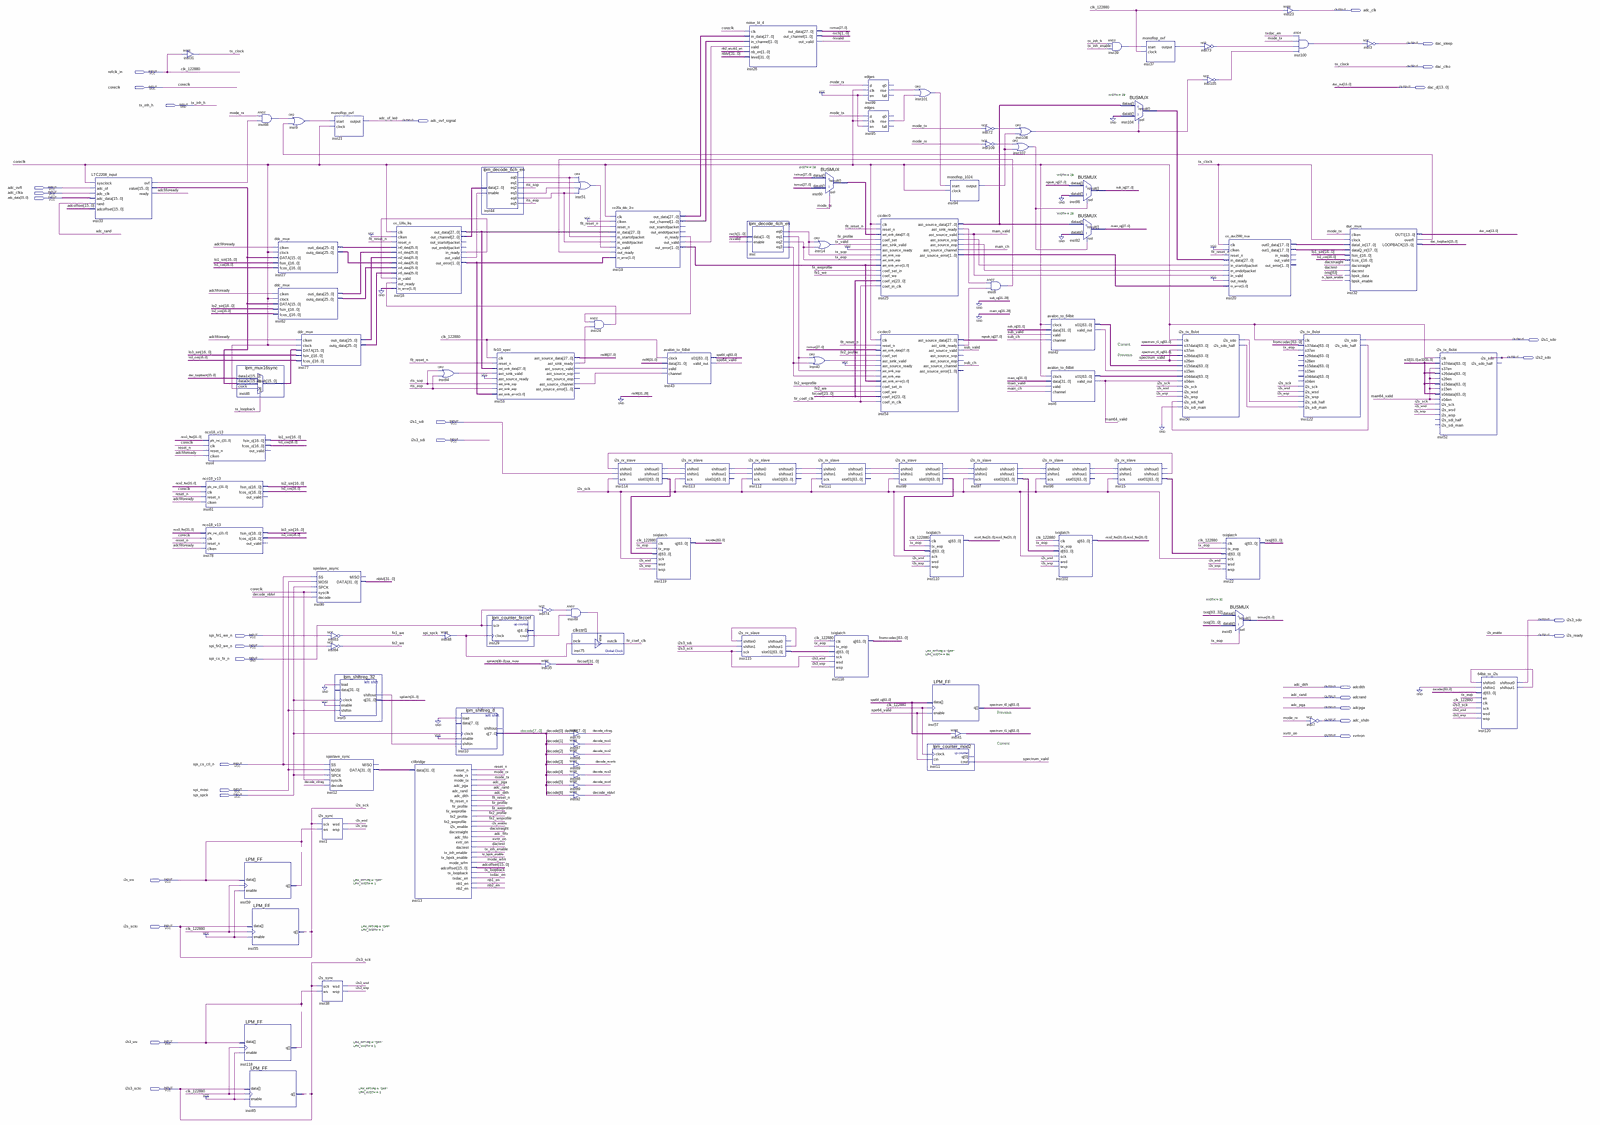
[diagram p0: schematic sheet, whole]
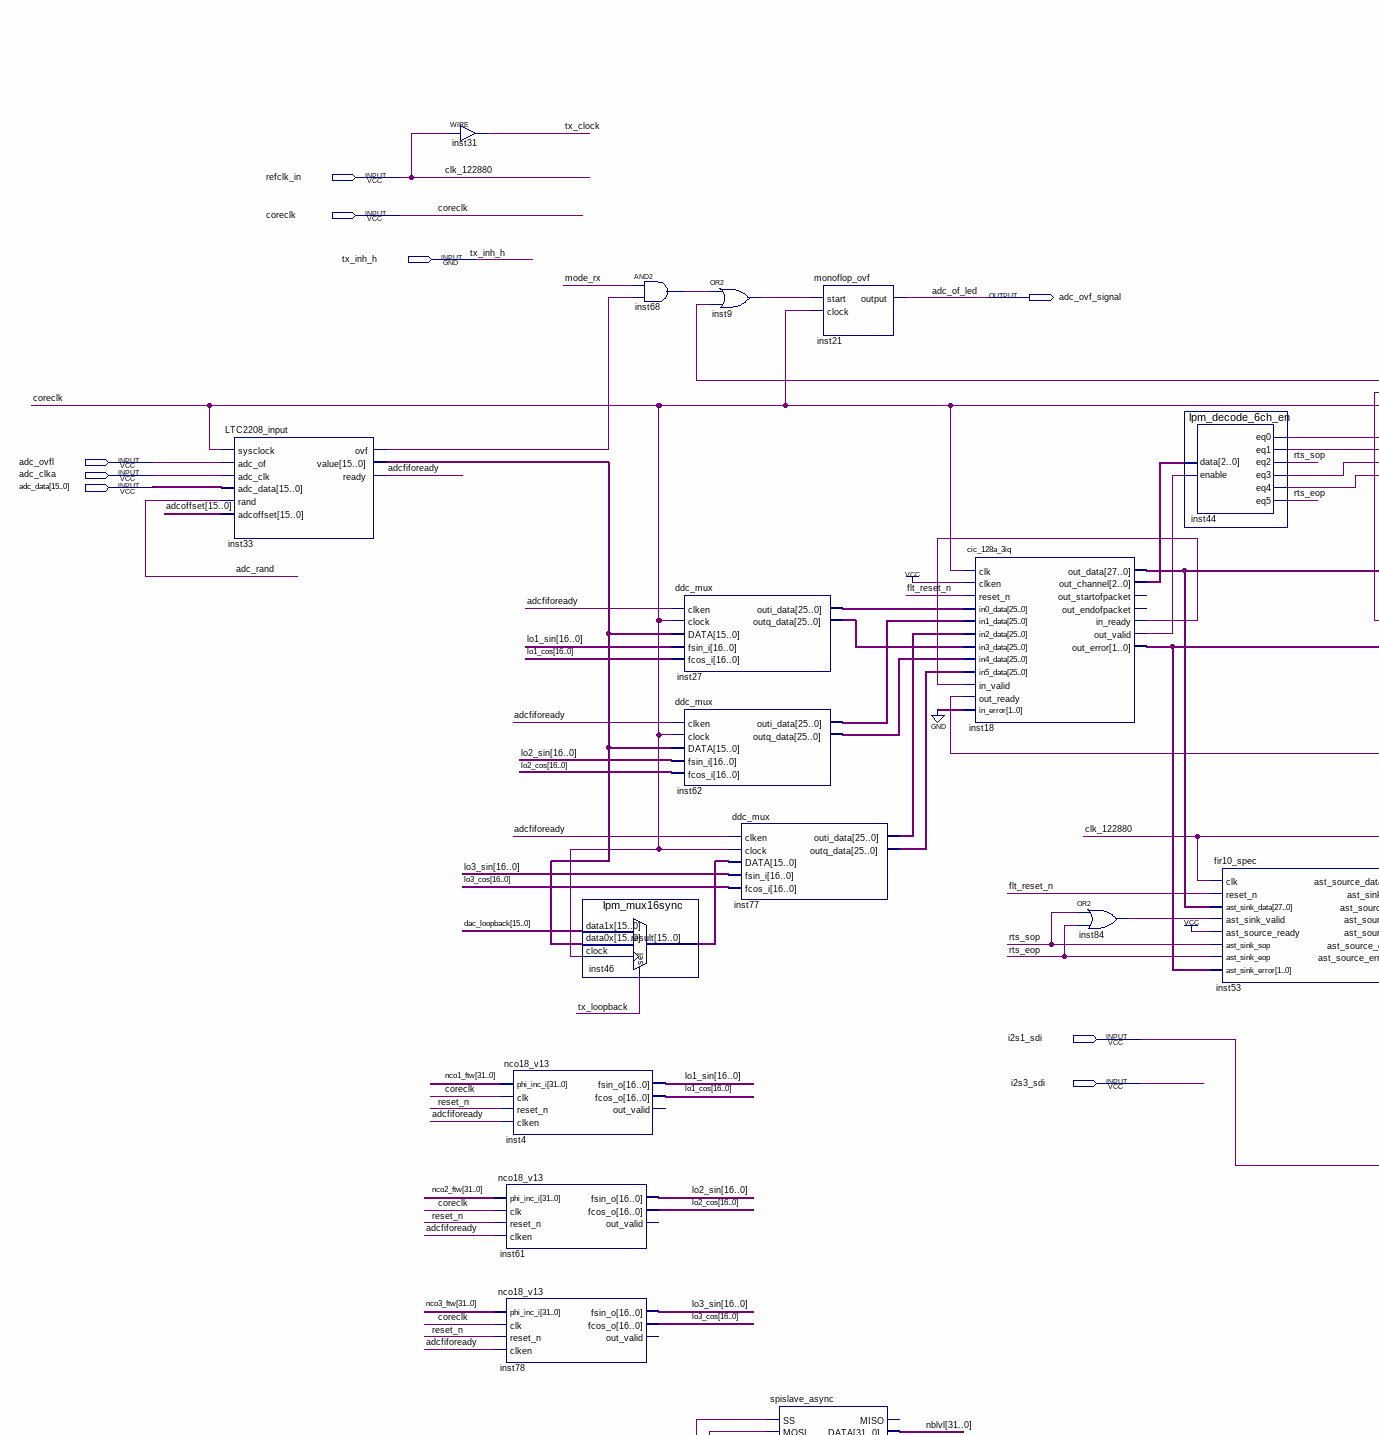
[diagram p1: schematic sheet, upper left part]
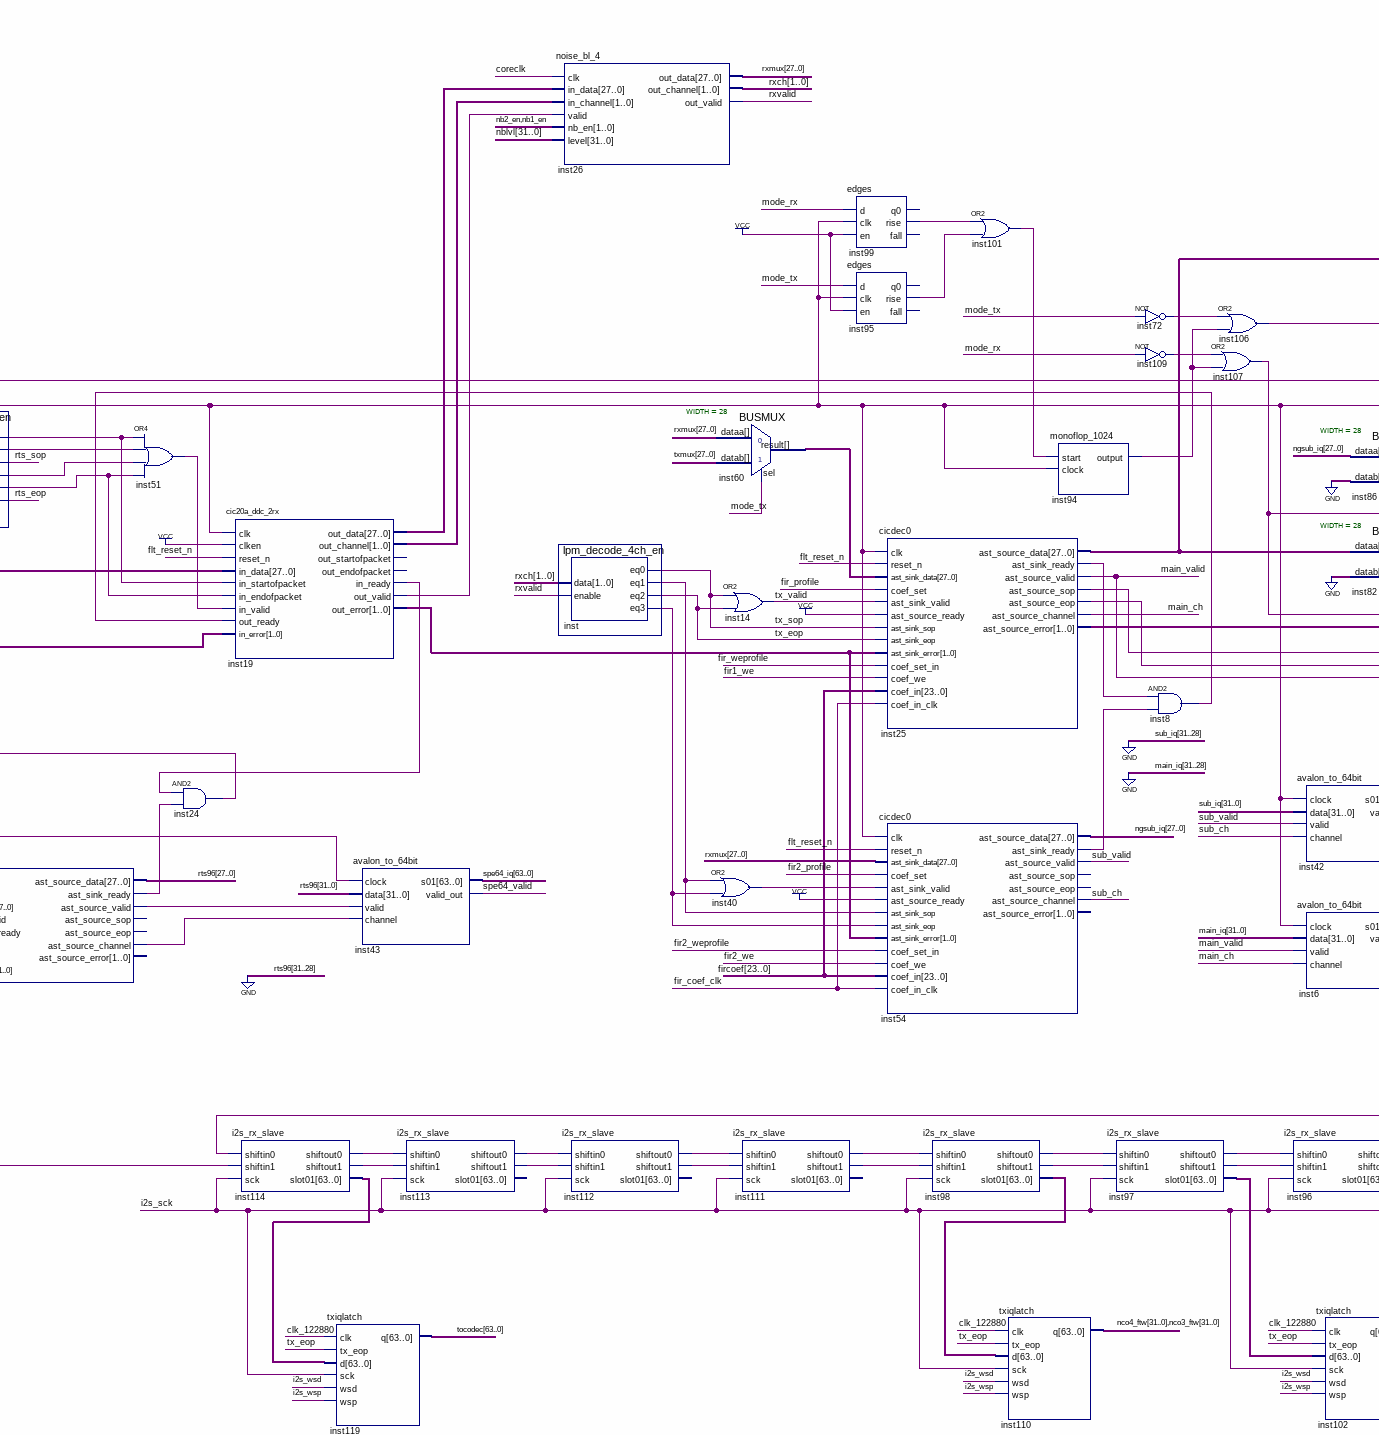
[diagram p2: schematic sheet, upper centre part]
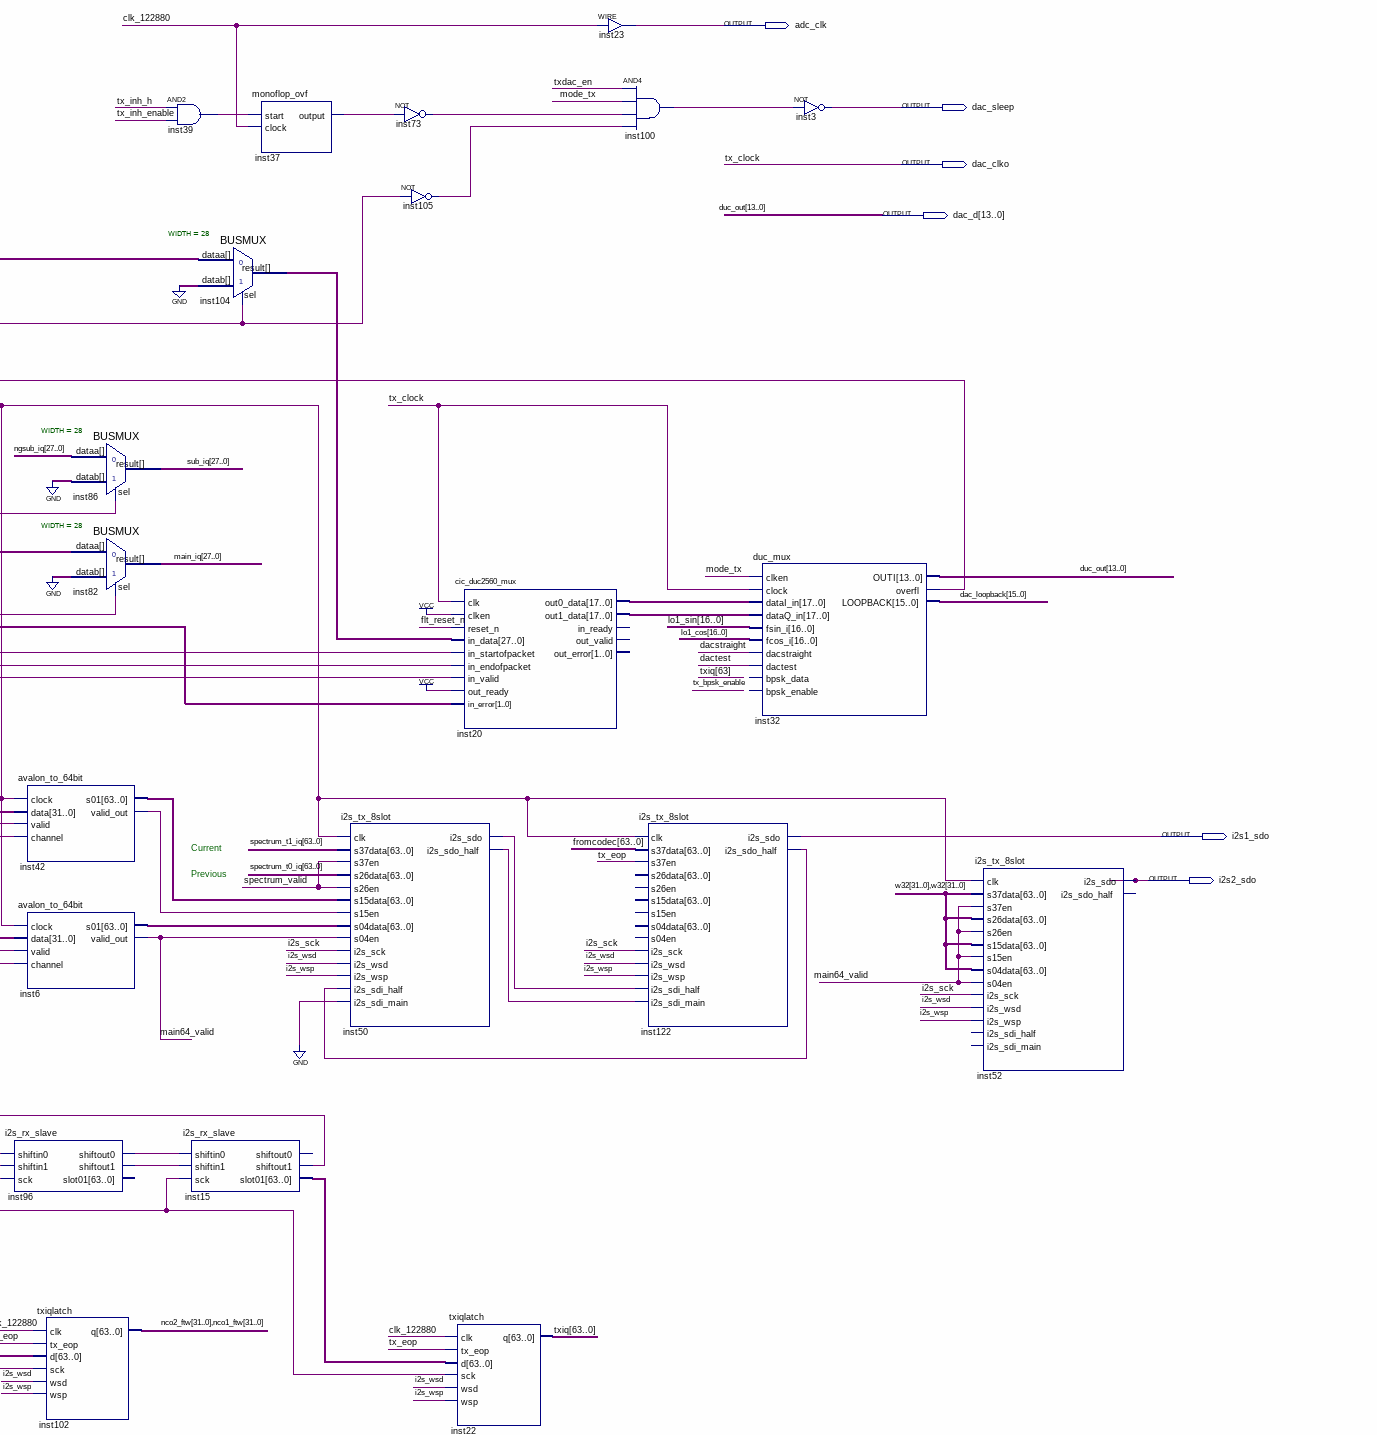
[diagram p3: schematic sheet, upper right part]
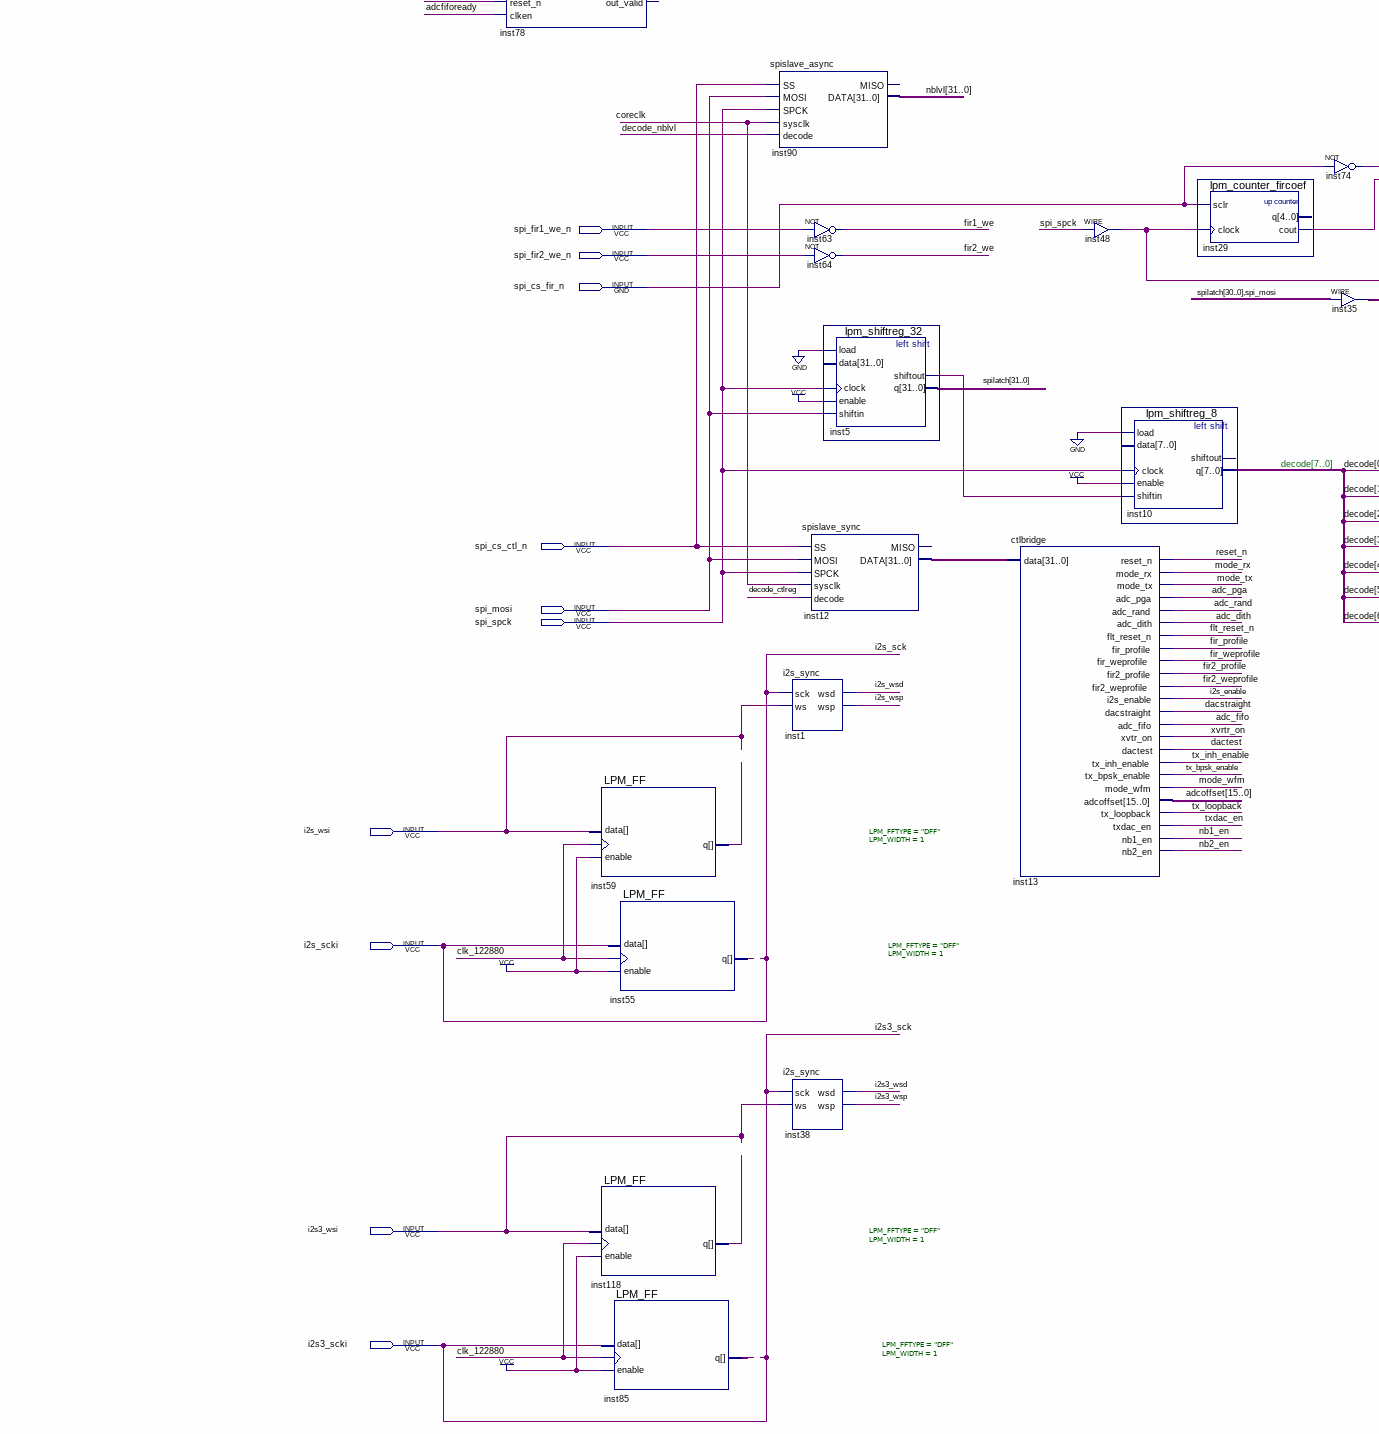
[diagram p4: schematic sheet, lower left part]
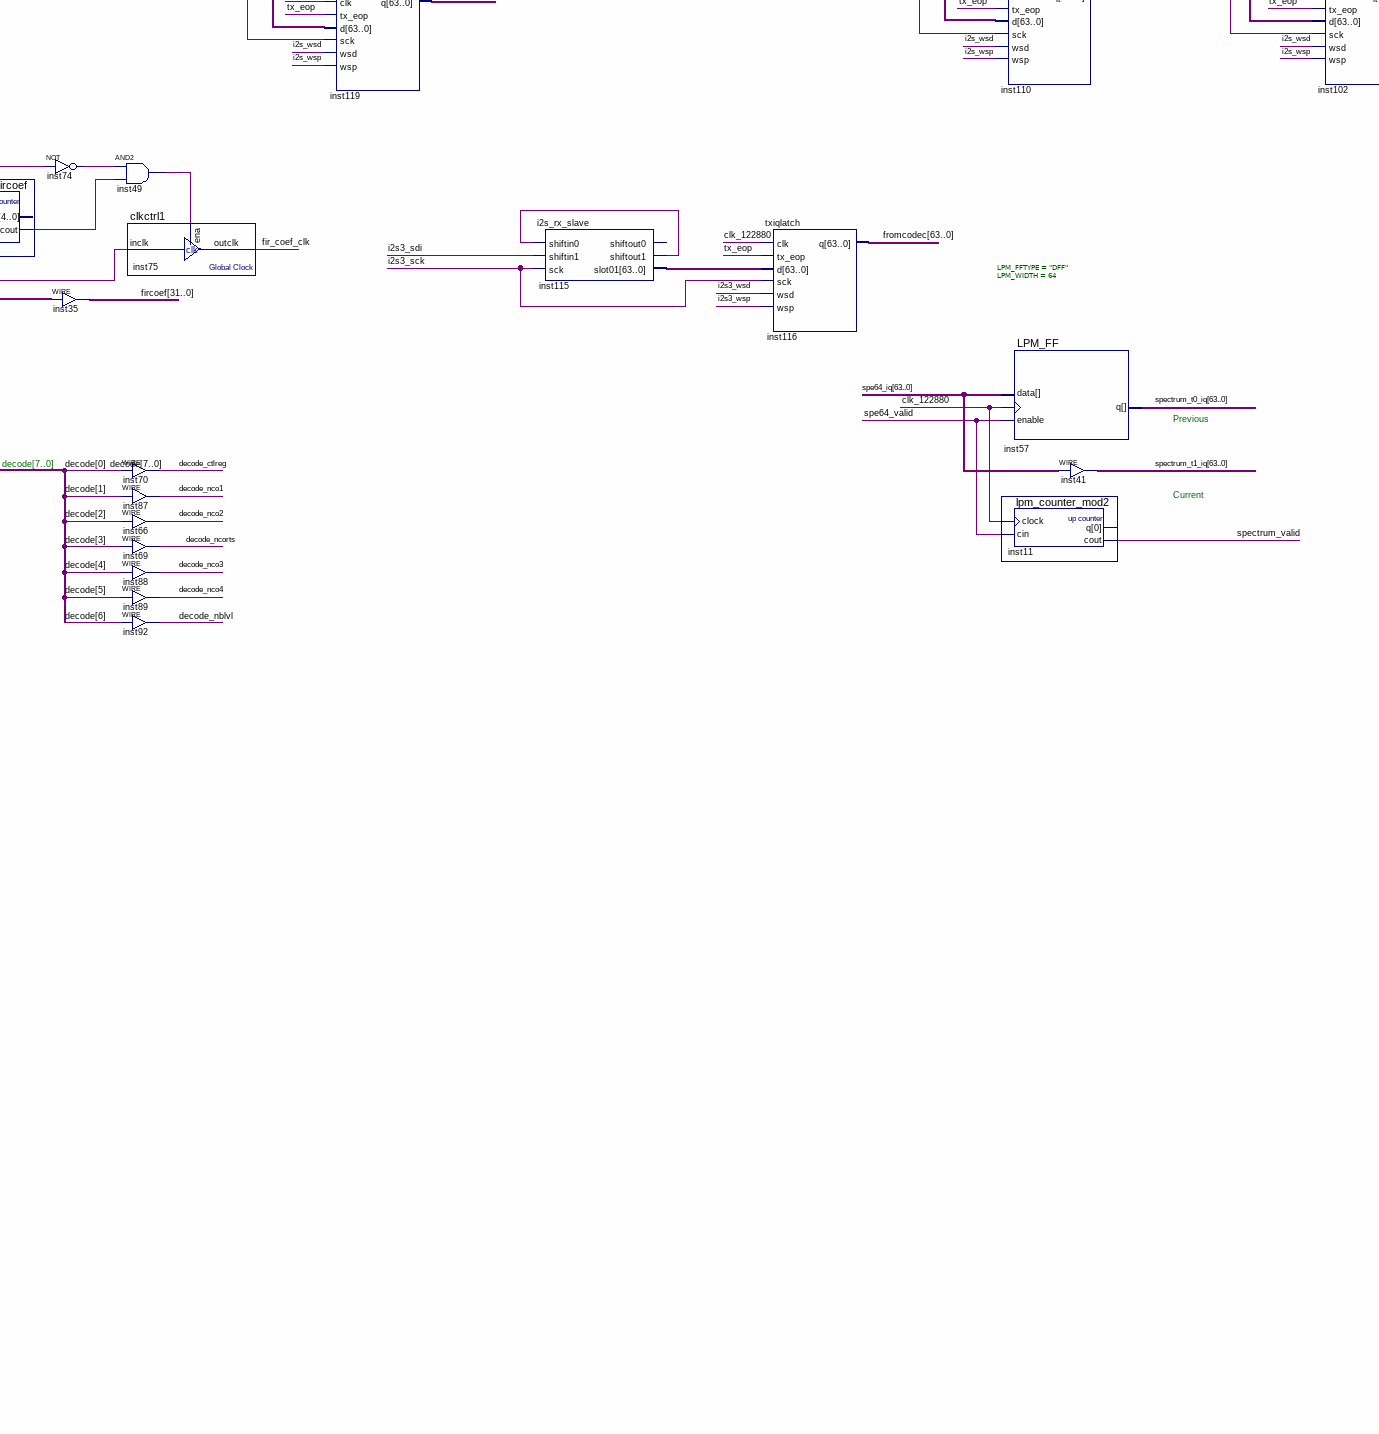
[diagram p5: schematic sheet, lower centre part]
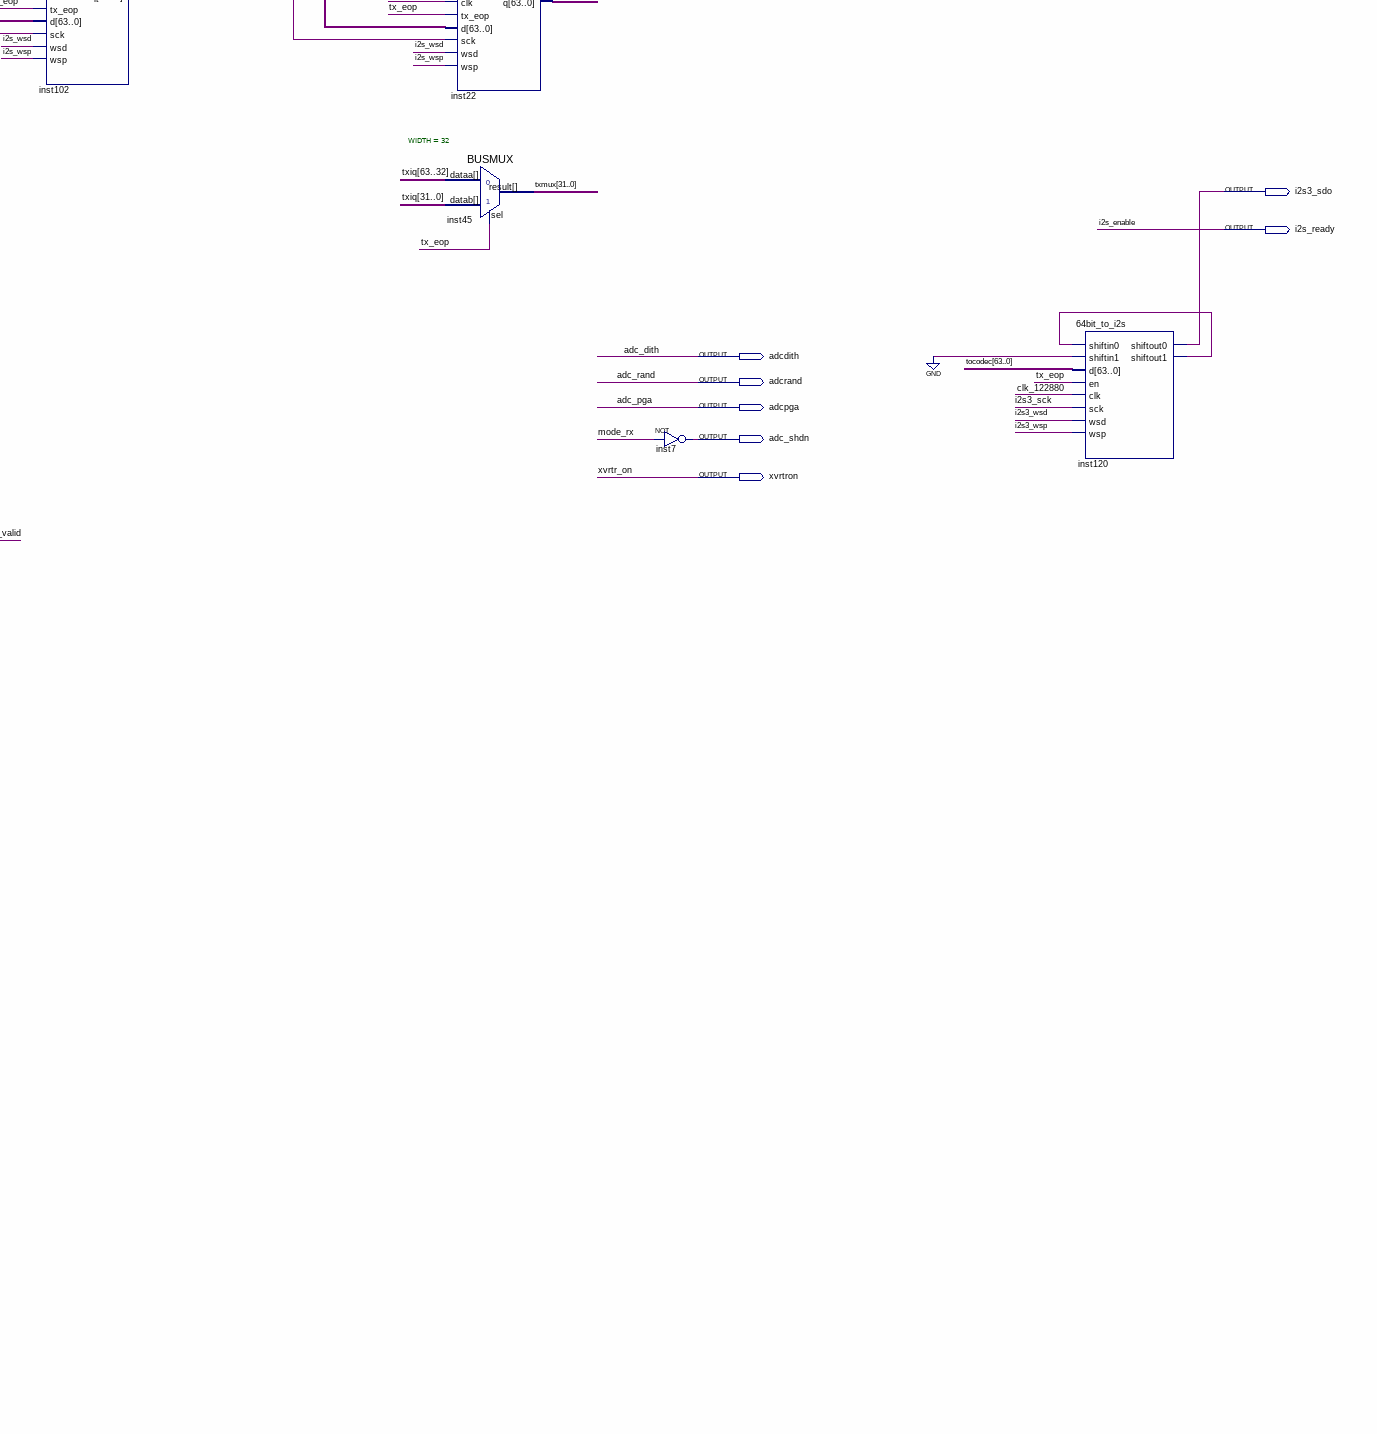
[diagram p6: schematic sheet, lower right part]
// Quartus schematic t1_2ch_transit.bdf as structural Verilog: 99 symbols, 32 pins
module t1_2ch_transit (
  input  refclk_in,
  input  coreclk,
  input  tx_inh_h,
  input  adc_ovfl,
  input  adc_clka,
  input  [15:0] adc_data,
  input  i2s1_sdi,
  input  i2s3_sdi,
  input  spi_fir1_we_n,
  input  spi_fir2_we_n,
  input  spi_cs_fir_n,
  input  spi_cs_ctl_n,
  input  spi_mosi,
  input  spi_spck,
  input  i2s_wsi,
  input  i2s_scki,
  input  i2s3_wsi,
  input  i2s3_scki,
  output adc_clk,
  output dac_sleep,
  output dac_clko,
  output [13:0] dac_d,
  output adc_ovf_signal,
  output i2s1_sdo,
  output i2s2_sdo,
  output i2s3_sdo,
  output i2s_ready,
  output adcdith,
  output adcrand,
  output adcpga,
  output adc_shdn,
  output xvrtron
);

  wire adc_fifo, adcfifoready, dacstraight, dactest, decode_ctlreg, decode_nblvl, decode_nco1, decode_nco2,
       decode_nco3, decode_nco4, decode_ncorts, fir1_we, fir2_profile, fir2_we, fir2_weprofile, fir_coef_clk,
       fir_profile, fir_weprofile, flt_reset_n, i2s3_wsd, i2s3_wsp, i2s_wsd, i2s_wsp, inst5_shiftout,
       inst8_out, inst9_out, inst15_shiftout1, inst18_in_ready, inst18_out_valid, inst19_in_ready,
       inst19_out_valid, inst24_out, inst25_ast_sink_ready, inst25_ast_source_eop, inst25_ast_source_sop,
       inst29_cout, inst32_overfl, inst33_ovf, inst37_output, inst39_out, inst40_out, inst42_valid_out,
       inst44_eq0, inst44_eq1, inst44_eq3, inst44_eq4, inst48_out, inst49_out, inst50_i2s_sdo,
       inst50_i2s_sdo_half, inst51_out, inst53_ast_sink_ready, inst53_ast_source_channel,
       inst53_ast_source_valid, inst54_ast_sink_ready, inst55_q, inst59_q, inst68_out, inst72_out,
       inst73_out, inst74_out, inst84_out, inst85_q, inst94_output, inst95_rise, inst96_shiftout0,
       inst96_shiftout1, inst97_shiftout0, inst97_shiftout1, inst98_shiftout0, inst98_shiftout1, inst99_rise,
       inst100_out, inst101_out, inst105_out, inst106_out, inst107_out, inst109_out, inst111_shiftout0,
       inst111_shiftout1, inst112_shiftout0, inst112_shiftout1, inst113_shiftout0, inst113_shiftout1,
       inst114_shiftout0, inst114_shiftout1, inst115_shiftout1, inst118_q, inst120_shiftout1,
       inst122_i2s_sdo_half, inst_eq1, inst_eq3, main64_valid, main_ch, main_valid, mode_rx, mode_tx,
       mode_wfm, nb1_en, nb2_en, reset_n, rts_eop, rts_sop, rxvalid, spe64_valid, spectrum_valid, sub_ch,
       sub_valid, tx_bpsk_enable, tx_eop, tx_inh_enable, tx_loopback, tx_sop, tx_valid, txdac_en;
  wire [1:0] inst18_out_error, inst19_out_channel, inst19_out_error, inst25_ast_source_error, rxch;
  wire [2:0] inst18_out_channel;
  wire [7:0] decode;
  wire [15:0] adcoffset, dac_loopback, inst33_value, inst46_result;
  wire [16:0] lo1_cos, lo1_sin, lo2_cos, lo2_sin, lo3_cos, lo3_sin;
  wire [17:0] inst20_out0_data, inst20_out1_data;
  wire [25:0] inst27_outi_data, inst27_outq_data, inst62_outi_data, inst62_outq_data, inst77_outi_data,
       inst77_outq_data;
  wire [27:0] inst18_out_data, inst19_out_data, inst25_ast_source_data, inst60_result, inst104_result,
       main_iq, ngsub_iq, rts96, rxmux, sub_iq;
  wire [31:0] fircoef, inst12_data, nblvl, nco1_ftw, nco2_ftw, nco3_ftw, nco4_ftw, spilatch, txmux, w32;
  wire [63:0] fromcodec, inst6_s01, inst15_slot01, inst42_s01, inst97_slot01, inst98_slot01, inst114_slot01,
       inst115_slot01, spe64_iq, spectrum_t0_iq, spectrum_t1_iq, tocodec, txiq;

  LTC2208_input inst33 (
    .sysclock(coreclk), .adc_of(adc_ovfl), .adc_clk(adc_clka), .adc_data(adc_data), .\rand (adcrand),
    .adcoffset(adcoffset), .ovf(inst33_ovf), .value(inst33_value), .ready(adcfifoready));
  assign dac_clko = refclk_in;  // WIRE inst31
  nco18_v13 inst4 (
    .phi_inc_i(nco1_ftw), .clk(coreclk), .reset_n(reset_n), .clken(adcfifoready), .fsin_o(lo1_sin),
    .fcos_o(lo1_cos));  // open: out_valid
  nco18_v13 inst61 (
    .phi_inc_i(nco2_ftw), .clk(coreclk), .reset_n(reset_n), .clken(adcfifoready), .fsin_o(lo2_sin),
    .fcos_o(lo2_cos));  // open: out_valid
  nco18_v13 inst78 (
    .phi_inc_i(nco3_ftw), .clk(coreclk), .reset_n(reset_n), .clken(adcfifoready), .fsin_o(lo3_sin),
    .fcos_o(lo3_cos));  // open: out_valid
  lpm_mux16sync inst46 (
    .data1x(dac_loopback), .data0x(inst33_value), .clock(coreclk), .sel(tx_loopback), .result(inst46_result));
  LPM_FF #(.LPM_FFTYPE("DFF"), .LPM_WIDTH(1)) inst59 (.enable(1'b1), .clock(refclk_in), .data(i2s_wsi), .q(inst59_q));
  LPM_FF #(.LPM_FFTYPE("DFF"), .LPM_WIDTH(1)) inst118 (
    .enable(1'b1), .clock(refclk_in), .data(i2s3_wsi), .q(inst118_q));
  LPM_FF #(.LPM_FFTYPE("DFF"), .LPM_WIDTH(1)) inst85 (.enable(1'b1), .clock(refclk_in), .data(i2s3_scki), .q(inst85_q));
  and inst68 (inst68_out, mode_rx, inst33_ovf);
  LPM_FF #(.LPM_FFTYPE("DFF"), .LPM_WIDTH(1)) inst55 (.enable(1'b1), .clock(refclk_in), .data(i2s_scki), .q(inst55_q));
  ddc_mux inst27 (
    .clken(adcfifoready), .clock(coreclk), .DATA(inst33_value), .fsin_i(lo1_sin), .fcos_i(lo1_cos),
    .outi_data(inst27_outi_data), .outq_data(inst27_outq_data));
  ddc_mux inst62 (
    .clken(adcfifoready), .clock(coreclk), .DATA(inst33_value), .fsin_i(lo2_sin), .fcos_i(lo2_cos),
    .outi_data(inst62_outi_data), .outq_data(inst62_outq_data));
  or inst9 (inst9_out, inst68_out, inst32_overfl);
  ddc_mux inst77 (
    .clken(adcfifoready), .clock(coreclk), .DATA(inst46_result), .fsin_i(lo3_sin), .fcos_i(lo3_cos),
    .outi_data(inst77_outi_data), .outq_data(inst77_outq_data));
  spislave_async inst90 (
    .SS(spi_cs_ctl_n), .MOSI(spi_mosi), .SPCK(spi_spck), .sysclk(coreclk), .decode(decode_nblvl), .DATA(nblvl));  // open: MISO
  not inst63 (fir1_we, spi_fir1_we_n);
  not inst64 (fir2_we, spi_fir2_we_n);
  spislave_sync inst12 (
    .SS(spi_cs_ctl_n), .MOSI(spi_mosi), .SPCK(spi_spck), .sysclk(coreclk), .decode(decode_ctlreg),
    .DATA(inst12_data));  // open: MISO
  i2s_sync inst1 (.sck(i2s_scki), .ws(i2s_wsi), .wsd(i2s_wsd), .wsp(i2s_wsp));
  i2s_sync inst38 (.sck(i2s3_scki), .ws(i2s3_wsi), .wsd(i2s3_wsd), .wsp(i2s3_wsp));
  monoflop_ovf inst21 (.start(inst9_out), .clock(coreclk), .\output (adc_ovf_signal));
  lpm_shiftreg_32 inst5 (
    .load(1'b0), .clock(spi_spck), .enable(1'b1), .shiftin(spi_mosi), .shiftout(inst5_shiftout), .q(spilatch));  // open: data
  cic_128a_3iq inst18 (
    .clk(coreclk), .clken(1'b1), .reset_n(flt_reset_n), .in0_data(inst27_outi_data),
    .in1_data(inst62_outi_data), .in2_data(inst77_outi_data), .in3_data(inst27_outq_data),
    .in4_data(inst62_outq_data), .in5_data(inst77_outq_data), .in_valid(inst18_in_ready),
    .out_ready(inst24_out), .in_error(2'b00), .out_data(inst18_out_data), .out_channel(inst18_out_channel),
    .in_ready(inst18_in_ready), .out_valid(inst18_out_valid), .out_error(inst18_out_error));  // open: out_startofpacket, out_endofpacket
  ctlbridge inst13 (
    .data(inst12_data), .reset_n(reset_n), .mode_rx(mode_rx), .mode_tx(mode_tx), .adc_pga(adcpga),
    .adc_rand(adcrand), .adc_dith(adcdith), .flt_reset_n(flt_reset_n), .fir_profile(fir_profile),
    .fir_weprofile(fir_weprofile), .fir2_profile(fir2_profile), .fir2_weprofile(fir2_weprofile),
    .i2s_enable(i2s_ready), .dacstraight(dacstraight), .adc_fifo(adc_fifo), .xvtr_on(xvrtron),
    .dactest(dactest), .tx_inh_enable(tx_inh_enable), .tx_bpsk_enable(tx_bpsk_enable), .mode_wfm(mode_wfm),
    .adcoffset(adcoffset), .tx_loopback(tx_loopback), .txdac_en(txdac_en), .nb1_en(nb1_en), .nb2_en(nb2_en));
  or inst84 (inst84_out, rts_sop, rts_eop);
  assign inst48_out = spi_spck;  // WIRE inst48
  lpm_shiftreg_8 inst10 (
    .load(1'b0), .clock(spi_spck), .enable(1'b1), .shiftin(inst5_shiftout), .q(decode));  // open: data, shiftout
  lpm_decode_6ch_en inst44 (
    .data(inst18_out_channel), .enable(inst18_out_valid), .eq0(inst44_eq0), .eq1(inst44_eq1), .eq2(rts_sop),
    .eq3(inst44_eq3), .eq4(inst44_eq4), .eq5(rts_eop));
  fir10_spec inst53 (
    .clk(refclk_in), .reset_n(flt_reset_n), .ast_sink_data(inst18_out_data), .ast_sink_valid(inst84_out),
    .ast_source_ready(1'b1), .ast_sink_sop(rts_sop), .ast_sink_eop(rts_eop),
    .ast_sink_error(inst18_out_error), .ast_source_data(rts96), .ast_sink_ready(inst53_ast_sink_ready),
    .ast_source_valid(inst53_ast_source_valid), .ast_source_channel(inst53_ast_source_channel));  // open: ast_source_sop, ast_source_eop, ast_source_error
  lpm_counter_fircoef inst29 (.sclr(spi_cs_fir_n), .clock(inst48_out), .cout(inst29_cout));  // open: q
  not inst74 (inst74_out, spi_cs_fir_n);
  assign fircoef = {spilatch[30:0], spi_mosi};  // WIRE inst35
  or inst51 (inst51_out, inst44_eq0, inst44_eq1, inst44_eq3, inst44_eq4);
  and inst49 (inst49_out, inst74_out, inst29_cout);
  clkctrl1 inst75 (.inclk(inst48_out), .ena(inst49_out), .outclk(fir_coef_clk));
  assign decode_ctlreg = decode[0];  // WIRE inst70
  assign decode_nco1 = decode[1];  // WIRE inst87
  assign decode_nco2 = decode[2];  // WIRE inst66
  assign decode_ncorts = decode[3];  // WIRE inst69
  assign decode_nco3 = decode[4];  // WIRE inst88
  assign decode_nco4 = decode[5];  // WIRE inst89
  assign decode_nblvl = decode[6];  // WIRE inst92
  and inst24 (inst24_out, inst19_in_ready, inst53_ast_sink_ready);
  cic20a_ddc_2rx inst19 (
    .clk(coreclk), .clken(1'b1), .reset_n(flt_reset_n), .in_data(inst18_out_data),
    .in_startofpacket(inst44_eq0), .in_endofpacket(inst44_eq4), .in_valid(inst51_out), .out_ready(inst8_out),
    .in_error(inst18_out_error), .out_data(inst19_out_data), .out_channel(inst19_out_channel),
    .in_ready(inst19_in_ready), .out_valid(inst19_out_valid), .out_error(inst19_out_error));  // open: out_startofpacket, out_endofpacket
  i2s_rx_slave inst114 (
    .shiftin0(inst15_shiftout1), .shiftin1(i2s1_sdi), .sck(i2s_scki), .shiftout0(inst114_shiftout0),
    .shiftout1(inst114_shiftout1), .slot01(inst114_slot01));
  txiqlatch inst119 (
    .clk(refclk_in), .tx_eop(tx_eop), .d(inst114_slot01), .sck(i2s_scki), .wsd(i2s_wsd), .wsp(i2s_wsp),
    .q(tocodec));
  avalon_to_64bit inst43 (
    .clock(refclk_in), .data({4'b0000, rts96}), .valid(inst53_ast_source_valid),
    .channel(inst53_ast_source_channel), .s01(spe64_iq), .valid_out(spe64_valid));
  i2s_rx_slave inst113 (
    .shiftin0(inst114_shiftout0), .shiftin1(inst114_shiftout1), .sck(i2s_scki),
    .shiftout0(inst113_shiftout0), .shiftout1(inst113_shiftout1));  // open: slot01
  i2s_rx_slave inst115 (
    .shiftin0(inst115_shiftout1), .shiftin1(i2s3_sdi), .sck(i2s3_scki), .shiftout1(inst115_shiftout1),
    .slot01(inst115_slot01));  // open: shiftout0
  noise_bl_4 inst26 (
    .clk(coreclk), .in_data(inst19_out_data), .in_channel(inst19_out_channel), .valid(inst19_out_valid),
    .nb_en({nb2_en, nb1_en}), .level(nblvl), .out_data(rxmux), .out_channel(rxch), .out_valid(rxvalid));
  lpm_decode_4ch_en inst (.data(rxch), .enable(rxvalid), .eq0(tx_sop), .eq1(inst_eq1), .eq2(tx_eop), .eq3(inst_eq3));
  i2s_rx_slave inst112 (
    .shiftin0(inst113_shiftout0), .shiftin1(inst113_shiftout1), .sck(i2s_scki),
    .shiftout0(inst112_shiftout0), .shiftout1(inst112_shiftout1));  // open: slot01
  BUSMUX #(.WIDTH(28)) inst60 (.datab(txmux[27:0]), .sel(mode_tx), .dataa(rxmux), .result(inst60_result));
  or inst14 (tx_valid, tx_sop, tx_eop);
  or inst40 (inst40_out, inst_eq1, inst_eq3);
  i2s_rx_slave inst111 (
    .shiftin0(inst112_shiftout0), .shiftin1(inst112_shiftout1), .sck(i2s_scki),
    .shiftout0(inst111_shiftout0), .shiftout1(inst111_shiftout1));  // open: slot01
  txiqlatch inst116 (
    .clk(refclk_in), .tx_eop(tx_eop), .d(inst115_slot01), .sck(i2s3_scki), .wsd(i2s3_wsd), .wsp(i2s3_wsp),
    .q(fromcodec));
  edges inst99 (.d(mode_rx), .clk(coreclk), .en(1'b1), .rise(inst99_rise));  // open: q0, fall
  edges inst95 (.d(mode_tx), .clk(coreclk), .en(1'b1), .rise(inst95_rise));  // open: q0, fall
  cicdec0 inst25 (
    .clk(coreclk), .reset_n(flt_reset_n), .ast_sink_data(inst60_result), .coef_set(fir_profile),
    .ast_sink_valid(tx_valid), .ast_source_ready(1'b1), .ast_sink_sop(tx_sop), .ast_sink_eop(tx_eop),
    .ast_sink_error(inst19_out_error), .coef_set_in(fir_weprofile), .coef_we(fir1_we),
    .coef_in(fircoef[23:0]), .coef_in_clk(fir_coef_clk), .ast_source_data(inst25_ast_source_data),
    .ast_sink_ready(inst25_ast_sink_ready), .ast_source_valid(main_valid),
    .ast_source_sop(inst25_ast_source_sop), .ast_source_eop(inst25_ast_source_eop),
    .ast_source_channel(main_ch), .ast_source_error(inst25_ast_source_error));
  cicdec0 inst54 (
    .clk(coreclk), .reset_n(flt_reset_n), .ast_sink_data(rxmux), .coef_set(fir2_profile),
    .ast_sink_valid(inst40_out), .ast_source_ready(1'b1), .ast_sink_sop(inst_eq1), .ast_sink_eop(inst_eq3),
    .ast_sink_error(inst19_out_error), .coef_set_in(fir2_weprofile), .coef_we(fir2_we),
    .coef_in(fircoef[23:0]), .coef_in_clk(fir_coef_clk), .ast_source_data(ngsub_iq),
    .ast_sink_ready(inst54_ast_sink_ready), .ast_source_valid(sub_valid), .ast_source_channel(sub_ch));  // open: ast_source_sop, ast_source_eop, ast_source_error
  i2s_rx_slave inst98 (
    .shiftin0(inst111_shiftout0), .shiftin1(inst111_shiftout1), .sck(i2s_scki), .shiftout0(inst98_shiftout0),
    .shiftout1(inst98_shiftout1), .slot01(inst98_slot01));
  or inst101 (inst101_out, inst99_rise, inst95_rise);
  txiqlatch inst110 (
    .clk(refclk_in), .tx_eop(tx_eop), .d(inst98_slot01), .sck(i2s_scki), .wsd(i2s_wsd), .wsp(i2s_wsp),
    .q({nco4_ftw, nco3_ftw}));
  monoflop_1024 inst94 (.start(inst101_out), .clock(coreclk), .\output (inst94_output));
  LPM_FF #(.LPM_FFTYPE("DFF"), .LPM_WIDTH(64)) inst57 (
    .enable(spe64_valid), .clock(refclk_in), .data(spe64_iq), .q(spectrum_t0_iq));
  lpm_counter_mod2 inst11 (.clock(refclk_in), .cin(spe64_valid), .cout(spectrum_valid));  // open: q
  assign spectrum_t1_iq = spe64_iq;  // WIRE inst41
  not inst72 (inst72_out, mode_tx);
  not inst109 (inst109_out, mode_rx);
  and inst8 (inst8_out, inst25_ast_sink_ready, inst54_ast_sink_ready);
  i2s_rx_slave inst97 (
    .shiftin0(inst98_shiftout0), .shiftin1(inst98_shiftout1), .sck(i2s_scki), .shiftout0(inst97_shiftout0),
    .shiftout1(inst97_shiftout1), .slot01(inst97_slot01));
  or inst106 (inst106_out, inst72_out, inst94_output);
  or inst107 (inst107_out, inst109_out, inst94_output);
  avalon_to_64bit inst42 (
    .clock(coreclk), .data({4'b0000, sub_iq}), .valid(sub_valid), .channel(sub_ch), .s01(inst42_s01),
    .valid_out(inst42_valid_out));
  avalon_to_64bit inst6 (
    .clock(coreclk), .data({4'b0000, main_iq}), .valid(main_valid), .channel(main_ch), .s01(inst6_s01),
    .valid_out(main64_valid));
  i2s_rx_slave inst96 (
    .shiftin0(inst97_shiftout0), .shiftin1(inst97_shiftout1), .sck(i2s_scki), .shiftout0(inst96_shiftout0),
    .shiftout1(inst96_shiftout1));  // open: slot01
  BUSMUX #(.WIDTH(28)) inst86 (.datab({28{1'b0}}), .sel(inst107_out), .dataa(ngsub_iq), .result(sub_iq));
  BUSMUX #(.WIDTH(28)) inst82 (.datab({28{1'b0}}), .sel(inst107_out), .dataa(inst25_ast_source_data), .result(main_iq));
  txiqlatch inst102 (
    .clk(refclk_in), .tx_eop(tx_eop), .d(inst97_slot01), .sck(i2s_scki), .wsd(i2s_wsd), .wsp(i2s_wsp),
    .q({nco2_ftw, nco1_ftw}));
  and inst39 (inst39_out, tx_inh_h, tx_inh_enable);
  BUSMUX #(.WIDTH(28)) inst104 (
    .datab({28{1'b0}}), .sel(inst106_out), .dataa(inst25_ast_source_data), .result(inst104_result));
  i2s_rx_slave inst15 (
    .shiftin0(inst96_shiftout0), .shiftin1(inst96_shiftout1), .sck(i2s_scki), .shiftout1(inst15_shiftout1),
    .slot01(inst15_slot01));  // open: shiftout0
  monoflop_ovf inst37 (.start(inst39_out), .clock(refclk_in), .\output (inst37_output));
  i2s_tx_8slot inst50 (
    .clk(coreclk), .s37data(spectrum_t1_iq), .s37en(spectrum_valid), .s26data(spectrum_t0_iq),
    .s26en(spectrum_valid), .s15data(inst42_s01), .s15en(inst42_valid_out), .s04data(inst6_s01),
    .s04en(main64_valid), .i2s_sck(i2s_scki), .i2s_wsd(i2s_wsd), .i2s_wsp(i2s_wsp),
    .i2s_sdi_half(inst122_i2s_sdo_half), .i2s_sdi_main(1'b0), .i2s_sdo(inst50_i2s_sdo),
    .i2s_sdo_half(inst50_i2s_sdo_half));
  not inst73 (inst73_out, inst37_output);
  not inst105 (inst105_out, inst106_out);
  cic_duc2560_mux inst20 (
    .clk(dac_clko), .clken(1'b1), .reset_n(flt_reset_n), .in_data(inst104_result),
    .in_startofpacket(inst25_ast_source_sop), .in_endofpacket(inst25_ast_source_eop), .in_valid(main_valid),
    .out_ready(1'b1), .in_error(inst25_ast_source_error), .out0_data(inst20_out0_data),
    .out1_data(inst20_out1_data));  // open: in_ready, out_valid, out_error
  txiqlatch inst22 (
    .clk(refclk_in), .tx_eop(tx_eop), .d(inst15_slot01), .sck(i2s_scki), .wsd(i2s_wsd), .wsp(i2s_wsp),
    .q(txiq));
  BUSMUX #(.WIDTH(32)) inst45 (.datab(txiq[31:0]), .sel(tx_eop), .dataa(txiq[63:32]), .result(txmux));
  assign adc_clk = refclk_in;  // WIRE inst23
  and inst100 (inst100_out, txdac_en, mode_tx, inst73_out, inst105_out);
  i2s_tx_8slot inst122 (
    .clk(coreclk), .s37data(fromcodec), .s37en(tx_eop), .i2s_sck(i2s_scki), .i2s_wsd(i2s_wsd),
    .i2s_wsp(i2s_wsp), .i2s_sdi_half(inst50_i2s_sdo), .i2s_sdi_main(inst50_i2s_sdo_half), .i2s_sdo(i2s1_sdo),
    .i2s_sdo_half(inst122_i2s_sdo_half));  // open: s26data, s26en, s15data, s15en, s04data, s04en
  not inst7 (adc_shdn, mode_rx);
  duc_mux inst32 (
    .clken(mode_tx), .clock(dac_clko), .dataI_in(inst20_out0_data), .dataQ_in(inst20_out1_data),
    .fsin_i(lo1_sin), .fcos_i(lo1_cos), .dacstraight(dacstraight), .dactest(dactest), .OUTI(dac_d),
    .overfl(inst32_overfl), .LOOPBACK(dac_loopback));  // open: bpsk_data, bpsk_enable
  not inst3 (dac_sleep, inst100_out);
  i2s_tx_8slot inst52 (
    .clk(coreclk), .s37data({w32, w32}), .s37en(main64_valid), .s26data({w32, w32}), .s26en(main64_valid),
    .s15data({w32, w32}), .s15en(main64_valid), .s04data({w32, w32}), .s04en(main64_valid),
    .i2s_sck(i2s_scki), .i2s_wsd(i2s_wsd), .i2s_wsp(i2s_wsp), .i2s_sdo(i2s2_sdo));  // open: i2s_sdi_half, i2s_sdi_main, i2s_sdo_half
  \64bit_to_i2s  inst120 (
    .shiftin0(inst120_shiftout1), .shiftin1(1'b0), .d(tocodec), .en(tx_eop), .clk(refclk_in),
    .sck(i2s3_scki), .wsd(i2s3_wsd), .wsp(i2s3_wsp), .shiftout0(i2s3_sdo), .shiftout1(inst120_shiftout1));

  // Other names for the same wires on the sheet: adc_dith = adcdith; adc_of_led = adc_ovf_signal; adc_pga = adcpga;
  //   adc_rand = adcrand; duc_out[13:0] = dac_d; i2s3_sck = i2s3_scki; i2s_enable = i2s_ready; i2s_sck = i2s_scki;
  //   clk_122880 = refclk_in; tx_clock = dac_clko; xvrtr_on = xvrtron

  // Notes on the sheet:
  //   Current
  //   Previous
  //   Previous
  //   decode[7..0]
  //   Current
endmodule
